# EAGLE design pydnp (EAGLE 7.2.0)
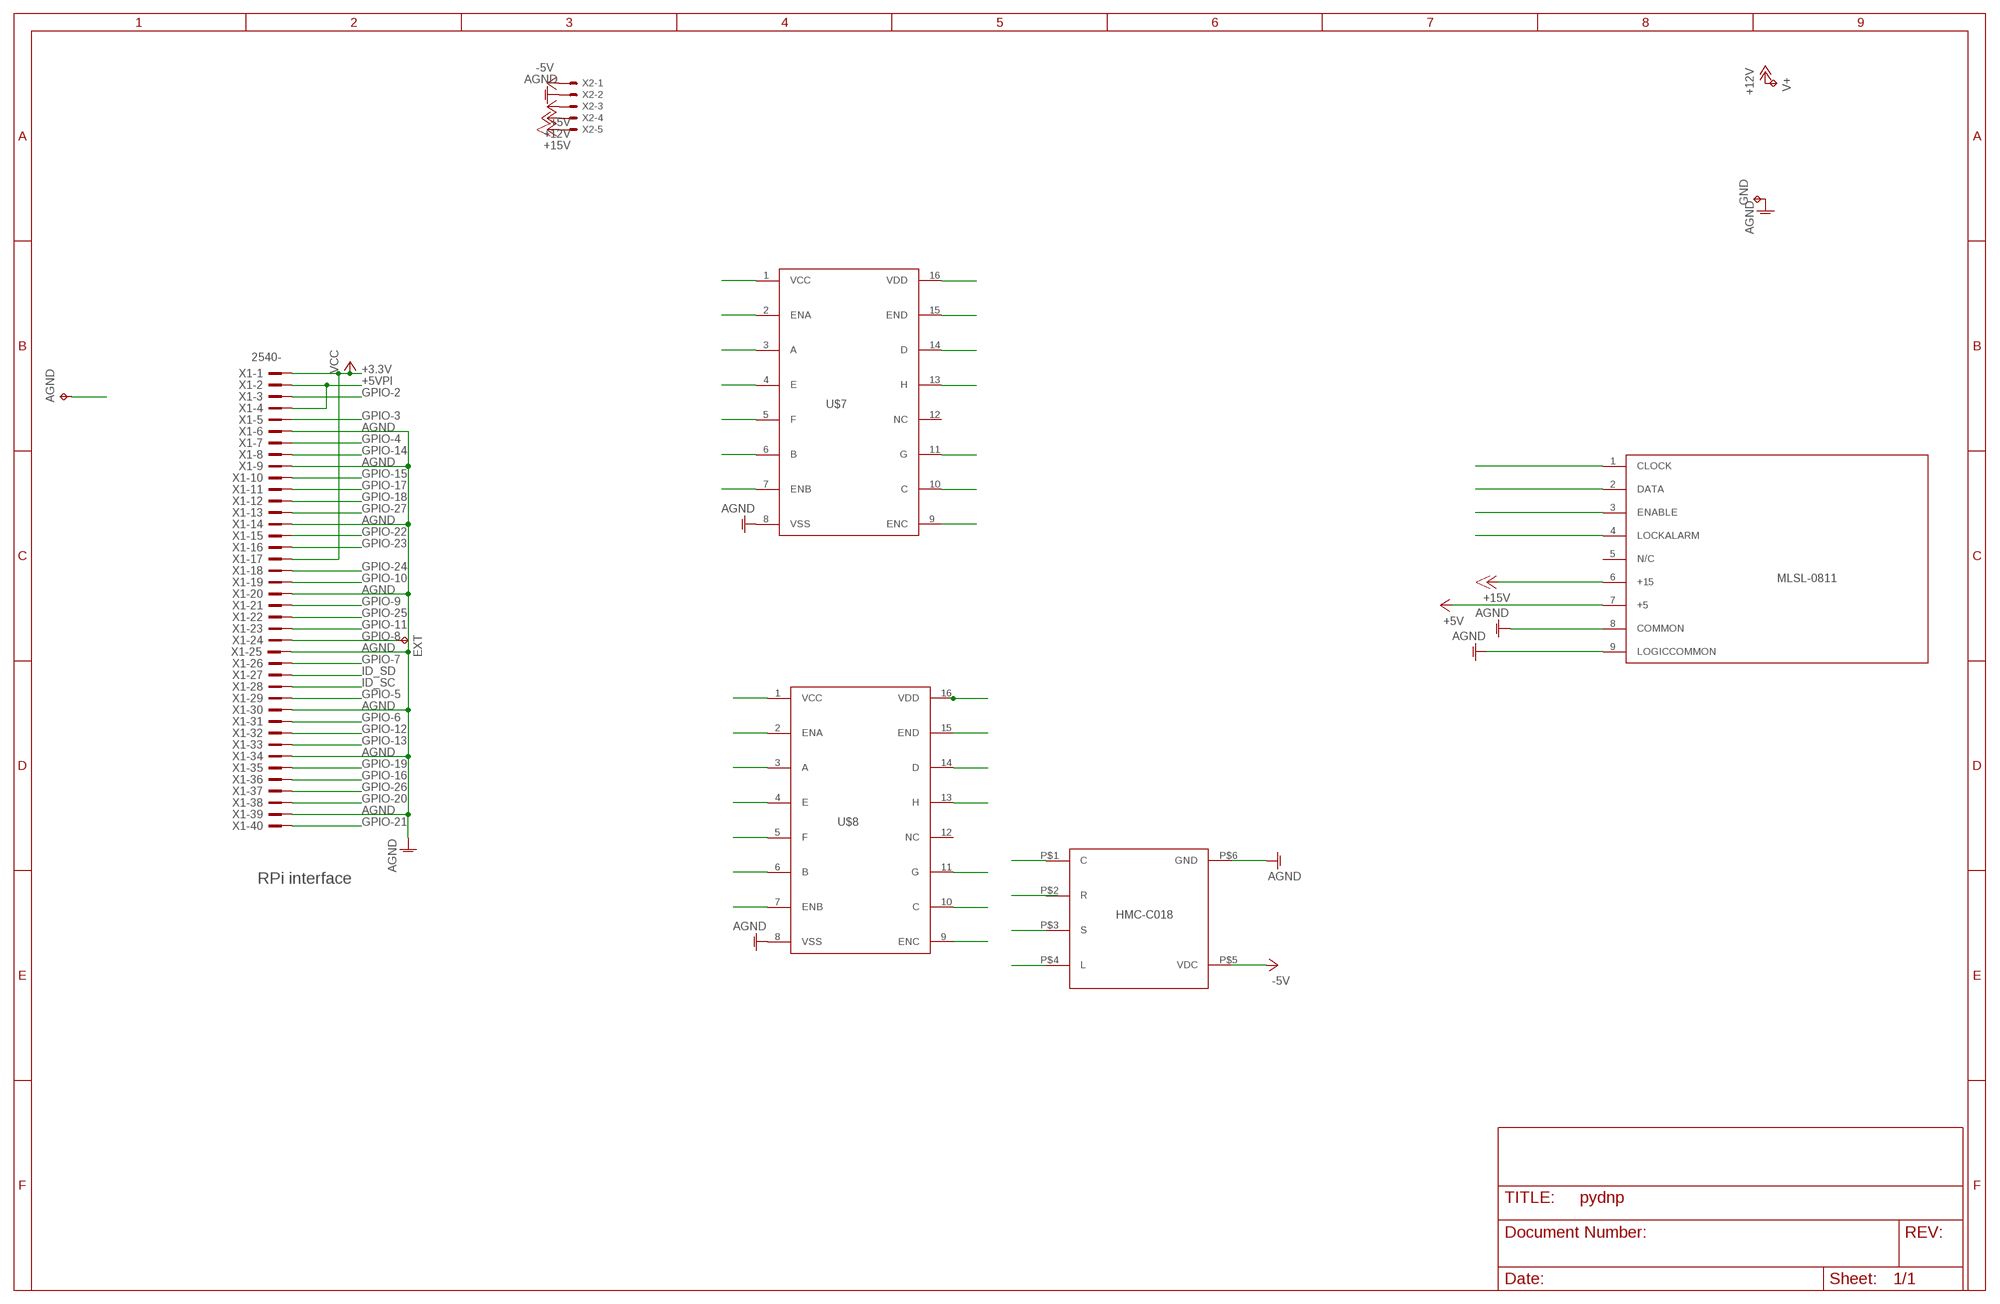
[diagram p0: schematic, sheet 1]

## Parts
AGND  TPPAD1-20Y  [P1-20Y]
EXT  TPPAD1-20Y  [P1-20Y]
GND  TPPAD1-20Y  [P1-20Y]
U$1  MLSLCORRECT  [177-009-FEMALE]
U$2  HMC-C018  [HMC-C018]
U$7  40109  [DIL16]
U$8  40109  [DIL16]
V+  TPPAD1-20Y  [P1-20Y]
X1  2540-  [PAK100/2500-40]
X2  KK-156-5  [KK-156-5]

## Nets
+3.3V: U$7.1(VCC) U$7.2(ENA) U$7.7(ENB) U$7.9(ENC) U$7.15(END) U$8.1(VCC) U$8.2(ENA) U$8.7(ENB) U$8.9(ENC) U$8.15(END) X1.1 X1.17 ; supply symbol labelled VCC
+5V: U$1.7(+5) X2.3
+5VPI: U$7.16(VDD) U$8.16(VDD) X1.2 X1.4
+12V: V+.TP X2.4
+15V: U$1.6(+15) X2.5
-5V: U$2.P$5(VDC) X2.1
AGND: AGND.TP GND.TP U$1.8(COMMON) U$1.9(LOGICCOMMON) U$2.P$6(GND) U$7.8(VSS) U$8.8(VSS) X1.6 X1.9 X1.14 X1.20 X1.25 X1.30 X1.34 X1.39 X2.2
C: U$2.P$1(C) U$8.4(E)
CLOCK: U$1.1(CLOCK) U$7.4(E)
DATA: U$1.2(DATA) U$7.13(H)
ENABLE: U$1.3(ENABLE) U$7.11(G)
GPIO-2: X1.3
GPIO-3: X1.5
GPIO-4: U$7.10(C) X1.7
GPIO-5: X1.29
GPIO-6: X1.31
GPIO-7: X1.26
GPIO-8: EXT.TP X1.24
GPIO-9: X1.21
GPIO-10: X1.19
GPIO-11: X1.23
GPIO-12: X1.32
GPIO-13: X1.33
GPIO-14: X1.8
GPIO-15: X1.10
GPIO-16: X1.36
GPIO-17: U$7.6(B) X1.11
GPIO-18: U$8.14(D) X1.12
GPIO-19: X1.35
GPIO-20: X1.38
GPIO-21: X1.40
GPIO-22: U$7.14(D) X1.15
GPIO-23: U$8.3(A) X1.16
GPIO-24: U$8.6(B) X1.18
GPIO-25: U$8.10(C) X1.22
GPIO-26: X1.37
GPIO-27: U$7.3(A) X1.13
ID_SC: X1.28
ID_SD: X1.27
L: U$2.P$4(L) U$8.5(F)
LOCK_ALARM: U$1.4(LOCKALARM) U$7.5(F)
R: U$2.P$2(R) U$8.13(H)
S: U$2.P$3(S) U$8.11(G)
Unconnected: U$1.5(N/C) U$7.12(NC) U$8.12(NC)

## Notes on the sheet
- GPIO-27
- RPi interface

## Library data of the parts
AGND EXT GND V+ = testpad:TP: Test pad
U$1 = microlambda:MLSL
U$2 = Hittite:HMC-C018
U$7 U$8 = 40xx:40109
X1 = con-3m:2540-: 3M (TM) Pak 100 4-Wall Header Source: 3M; OC_FARNELL: unknown; OC_NEWARK: unknown
X2 = con-molex:KK-156-5: KK 156 HEADER Source: http://www.molex.com/pdm_docs/sd/026604100_sd.pdf; OC_FARNELL: unknown; OC_NEWARK: unknown

## Board
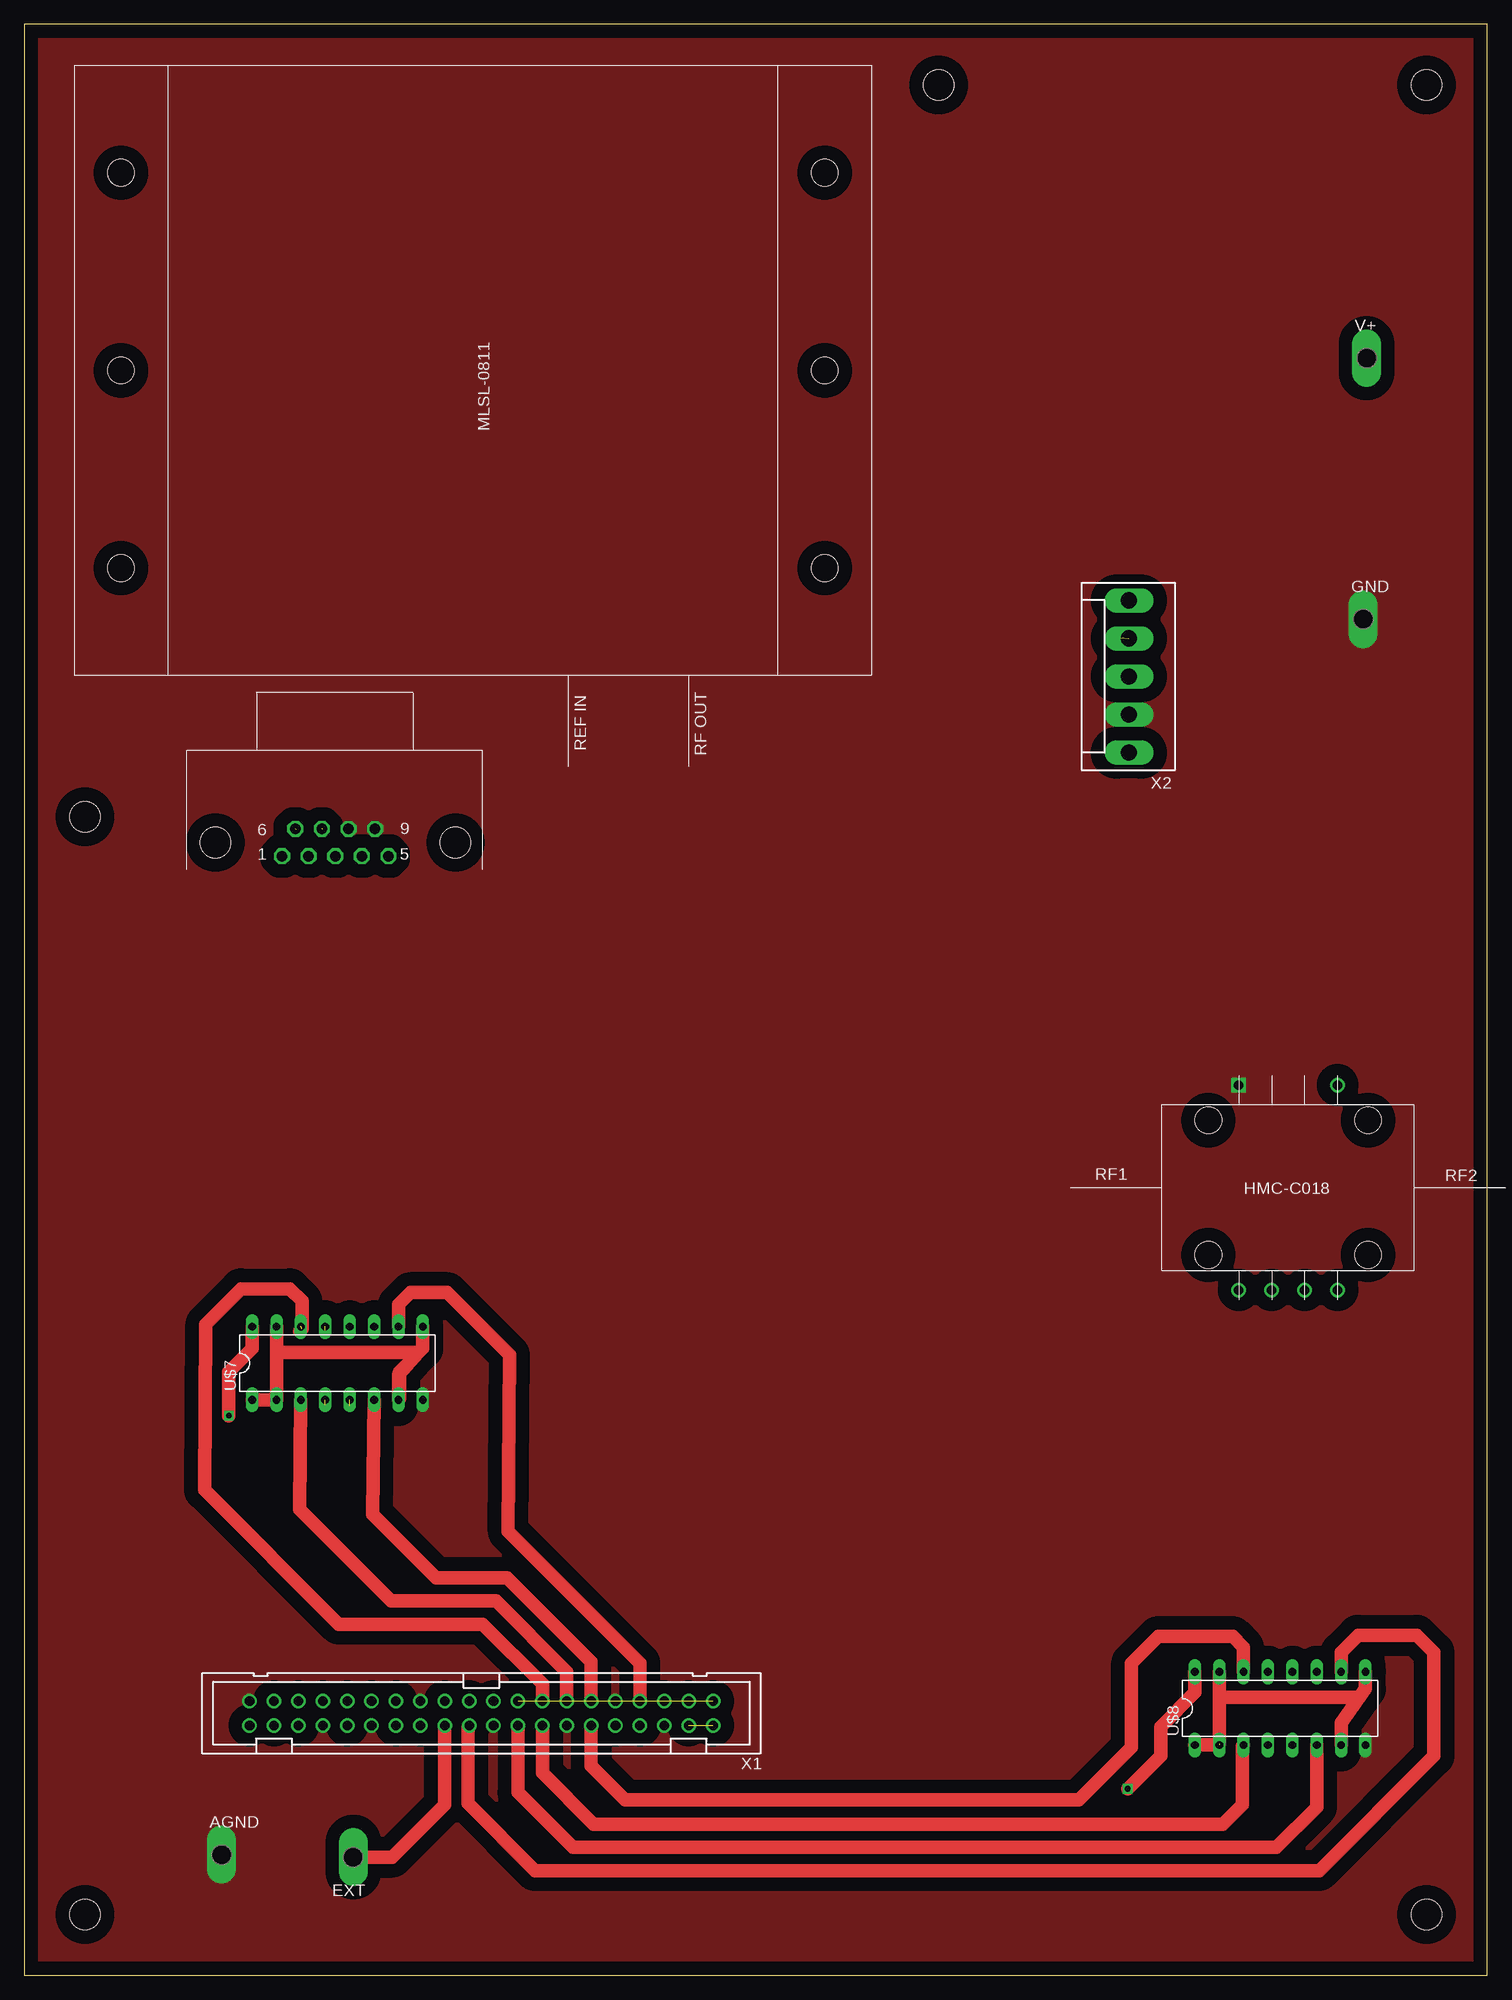
[diagram p1: board, top side]
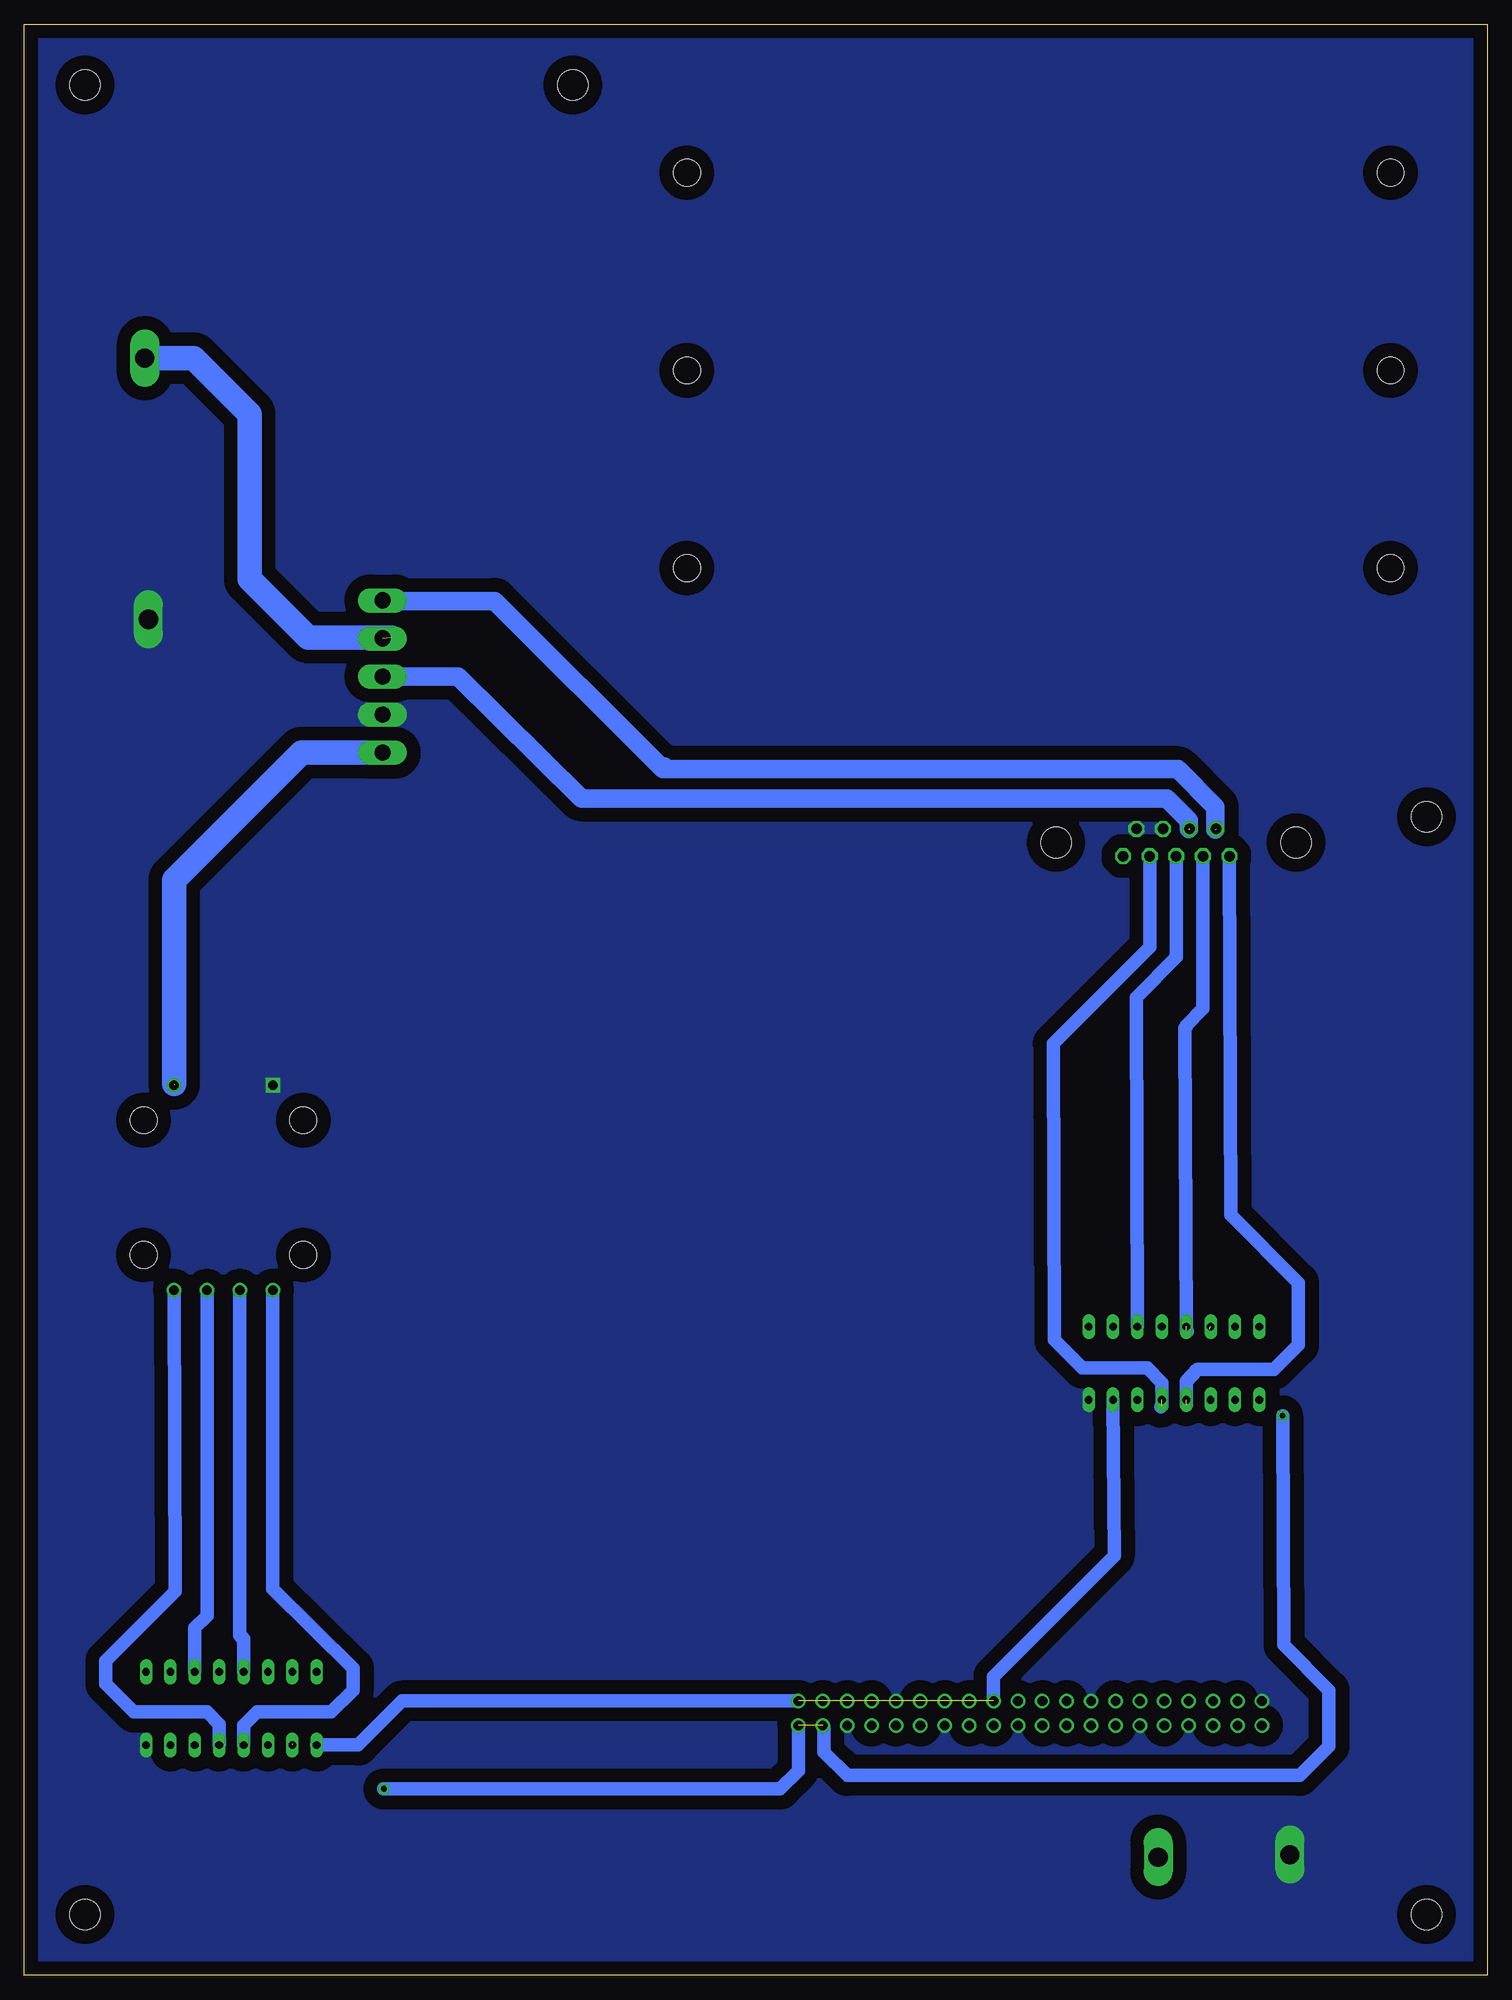
[diagram p2: board, bottom side, seen from below]

Size 152.4 x 203.2 mm. Coordinates in mm from the lower left corner, seen from the top.
Outline: 0,0 152.4,0 152.4,203.2 0,203.2 0,0
Copper layers (1*16): Top 0.035mm / dielectric 1.5mm / Bottom 0.035mm
Design rules "default": minimum track width 10mil, minimum drill 24mil, track to track 8mil, track to pad 8mil, pad to pad 8mil, via to via 8mil, smd to smd 8mil, copper to edge 40mil, drill to drill 8mil, minimum pad ring 10mil, minimum via ring 8mil, stop-mask expansion 4mil, vias tented up to drill 0mil, thermal gap 10mil
Holes 3.2 mm at 146.05,196.85 146.05,6.35 6.35,120.65 6.35,6.35 95.25,196.85

### Footprints (pad centres in the part's own frame; a part is rotated, then mirrored left to right if it is on the bottom)
P1-20Y = drill 2.007 pad 2.54 long: TP 0,0
177-009-FEMALE = drill 1.1 pad 1.524 octagon: 1 82.329,21.657; 2 82.329,24.427; 3 82.329,27.197; 4 82.329,29.967; 5 82.329,32.737; 6 79.489,23.042; 7 79.489,25.812; 8 79.489,28.582; 9 79.489,31.352 | hole 3.2: 80.909,39.717; 80.909,14.727 | hole 2.8: 11.176,4.889; 31.75,4.889; 52.324,4.889; 52.324,78.168; 31.75,78.168; 11.176,78.168
HMC-C018 = drill 1: P$1 8.001,-2.032; P$2 11.43,-2.032; P$3 14.859,-2.032; P$4 18.288,-2.032; P$5 18.288,19.304 | drill 1 square: P$6 8.001,19.304 | hole 2.8: 4.826,15.646; 21.463,15.646; 4.826,1.626; 21.463,1.626
DIL16 = drill 0.813 long: 1 -8.89,-3.81; 2 -6.35,-3.81; 3 -3.81,-3.81; 4 -1.27,-3.81; 5 1.27,-3.81; 6 3.81,-3.81; 7 6.35,-3.81; 8 8.89,-3.81; 9 8.89,3.81; 10 6.35,3.81; 11 3.81,3.81; 12 1.27,3.81; 13 -1.27,3.81; 14 -3.81,3.81; 15 -6.35,3.81; 16 -8.89,3.81
PAK100/2500-40 = drill 1 pad 1.422: 1 -24.13,-1.27; 2 -24.13,1.27; 3 -21.59,-1.27; 4 -21.59,1.27; 5 -19.05,-1.27; 6 -19.05,1.27; 7 -16.51,-1.27; 8 -16.51,1.27; 9 -13.97,-1.27; 10 -13.97,1.27; 11 -11.43,-1.27; 12 -11.43,1.27; 13 -8.89,-1.27; 14 -8.89,1.27; 15 -6.35,-1.27; 16 -6.35,1.27; 17 -3.81,-1.27; 18 -3.81,1.27; 19 -1.27,-1.27; 20 -1.27,1.27; 21 1.27,-1.27; 22 1.27,1.27; 23 3.81,-1.27; 24 3.81,1.27; 25 6.35,-1.27; 26 6.35,1.27; 27 8.89,-1.27; 28 8.89,1.27; 29 11.43,-1.27; 30 11.43,1.27; 31 13.97,-1.27; 32 13.97,1.27; 33 16.51,-1.27; 34 16.51,1.27; 35 19.05,-1.27; 36 19.05,1.27; 37 21.59,-1.27; 38 21.59,1.27; 39 24.13,-1.27; 40 24.13,1.27
KK-156-5 = drill 1.7 pad 2.184 long: 1 -7.92,0; 2 -3.96,0; 3 0,0; 4 3.96,0; 5 7.92,0

### Placement (x,y rotation side)
AGND  20.57,12.57 0 top
EXT  34.29,12.32 180 top
GND  139.45,141.22 0 top
U$1  5.21,198.88 270 top
U$2  118.49,73.41 0 top
U$7  32.64,63.75 0 top
U$8  130.81,27.81 0 top
V+  139.83,168.4 0 top
X1  47.62,27.3 180 top
X2  115.06,135.25 90 top

### Tracks (layer width: path | path; a pad name or v marks a point on that pad's centre or on a via)
+3.3V  (2 unrouted)
  Top 1.422: U$7.1 U$7.2 26.29,64.9 | 26.29,64.9 U$7.15 | U$8.15 124.46,28.96 | 124.46,28.96 124.46,24.13 124.21,24 U$8.1 | 139.06,28.96 139.7,29.84 U$8.9 | U$8.7 137.16,26.29 139.06,28.96 | 139.06,28.96 124.46,28.96 | U$7.9 41.53,65.28 39.12,62.87 39.12,60.07 U$7.7 38.99,62.61 41.02,64.9 26.29,64.9
  Bottom 1.422: X1.1 113.03,28.57 117.6,24 U$8.1 | U$7.7 38.86,43.69 51.44,31.11 X1.17
+5V  (1 unrouted)
  Bottom 1.93: 31.11,119.36 31.11,120.27 33.4,122.56 94.36,122.56 107.19,135.25 X2.3
+5VPI  (via drill 0.6)  (1 unrouted)
  Top 1.422: U$8.16 121.92,29.46 118.36,25.91 118.36,22.86 v114.94,19.43 | U$7.16 23.75,65.28 21.34,62.87 v21.34,58.29
  Bottom 1.422: v114.94,19.43 73.66,19.43 71.75,21.34 X1.2 | v21.34,58.29 21.21,34.42 16.51,29.72 16.51,23.88 19.56,20.83 66.67,20.83 69.09,23.24 69.09,25.91 X1.4
+12V  (1 unrouted)
  Bottom 2.54: V+.TP 134.75,168.4 128.91,162.56 128.91,145.41 122.81,139.32 114.17,139.32
+15V  (1 unrouted)
  Bottom 1.93: 28.32,119.34 28.32,121.67 32.26,125.6 85.85,125.6 | 85.85,125.6 85.72,125.86 | X2.5 115.02,143.13 103.38,143.13 85.85,125.6
-5V  (1 unrouted)
  Bottom 2.54: X2.1 123.49,127.33 136.78,114.05 136.78,92.84
AGND
  pour Bottom (isolate 1.422, no thermals): 0,0 152.4,0 152.4,203.2 0,203.2
  pour Top (isolate 1.422, no thermals): 0.25,203.2 152.4,203.2 152.4,-0.25 0,-0.25 0,203.2
C
  Bottom 1.422: U$2.P$1 126.49,40.26 118.11,32 118.11,29.72 120.4,27.43 128.14,27.43 129.54,26.04 U$8.4
CLOCK  (1 unrouted)
  Bottom 1.422: U$1.1 26.74,79.19 19.68,72.14 19.68,65.66 22.23,63.12 30.23,63.12 31.37,61.85 31.37,59.44
DATA  (1 unrouted)
  Bottom 1.422: U$1.2 29.63,100.67 31.37,98.93 31.37,98.81 31.5,98.68 31.37,67.18 31.24,67.06
ENABLE
  Bottom 1.422: U$1.3 32.4,106.03 36.58,101.85 U$7.11
GPIO-4
  Top 1.422: X1.7 64.14,32.51 50.42,46.23 50.55,64.64 44.07,71.12 40.26,71.12 38.99,69.85 U$7.10
GPIO-8
  Top 1.422: EXT.TP 38.35,12.32 43.81,17.78 X1.24
GPIO-17
  Top 1.422: X1.11 59.05,32.64 50.29,41.4 42.93,41.4 36.32,48.01 U$7.6
GPIO-18
  Top 1.422: X1.12 59.05,21.84 62.61,18.29 109.86,18.29 115.32,23.75 115.32,32.51 118.11,35.31 125.86,35.31 127,34.16 U$8.14
GPIO-22  (1 unrouted)
  Top 1.422: X1.15 53.98,30.35 47.75,36.58 32.77,36.58 18.8,50.55 18.92,67.82 22.61,71.5 27.69,71.5 28.96,70.23 28.96,67.31 28.7,67.06
GPIO-23
  Top 1.422: X1.16 53.98,21.08 59.31,15.75 124.84,15.75 126.87,17.78 126.87,23.88 U$8.3
GPIO-24
  Top 1.422: X1.18 51.44,19.05 57.15,13.34 130.43,13.34 134.62,17.53 U$8.6
GPIO-25
  Top 1.422: U$8.10 137.16,33.66 138.94,35.43 145.03,35.43 146.81,33.66 146.81,22.86 134.87,10.92 53.21,10.92 46.23,17.91 46.23,25.91 X1.22
GPIO-27
  Top 1.422: X1.13 56.52,31.62 49.15,38.99 38.23,38.99 28.7,48.51 U$7.3
L
  Bottom 1.422: U$2.P$4 136.65,40.01 143.89,32.77 143.89,30.35 140.97,27.43 133.35,27.43 132.08,26.16 U$8.5
LOCK_ALARM  (1 unrouted)
  Bottom 1.422: U$1.4 35.17,107.07 45.21,97.03 45.09,66.17 42.16,63.25 35.43,63.25 33.91,61.72 33.91,59.31 34.04,59.18
R
  Bottom 1.422: U$2.P$2 129.92,35.43 129.54,35.05 U$8.13
S
  Bottom 1.422: U$2.P$3 133.35,37.47 134.62,36.2 U$8.11